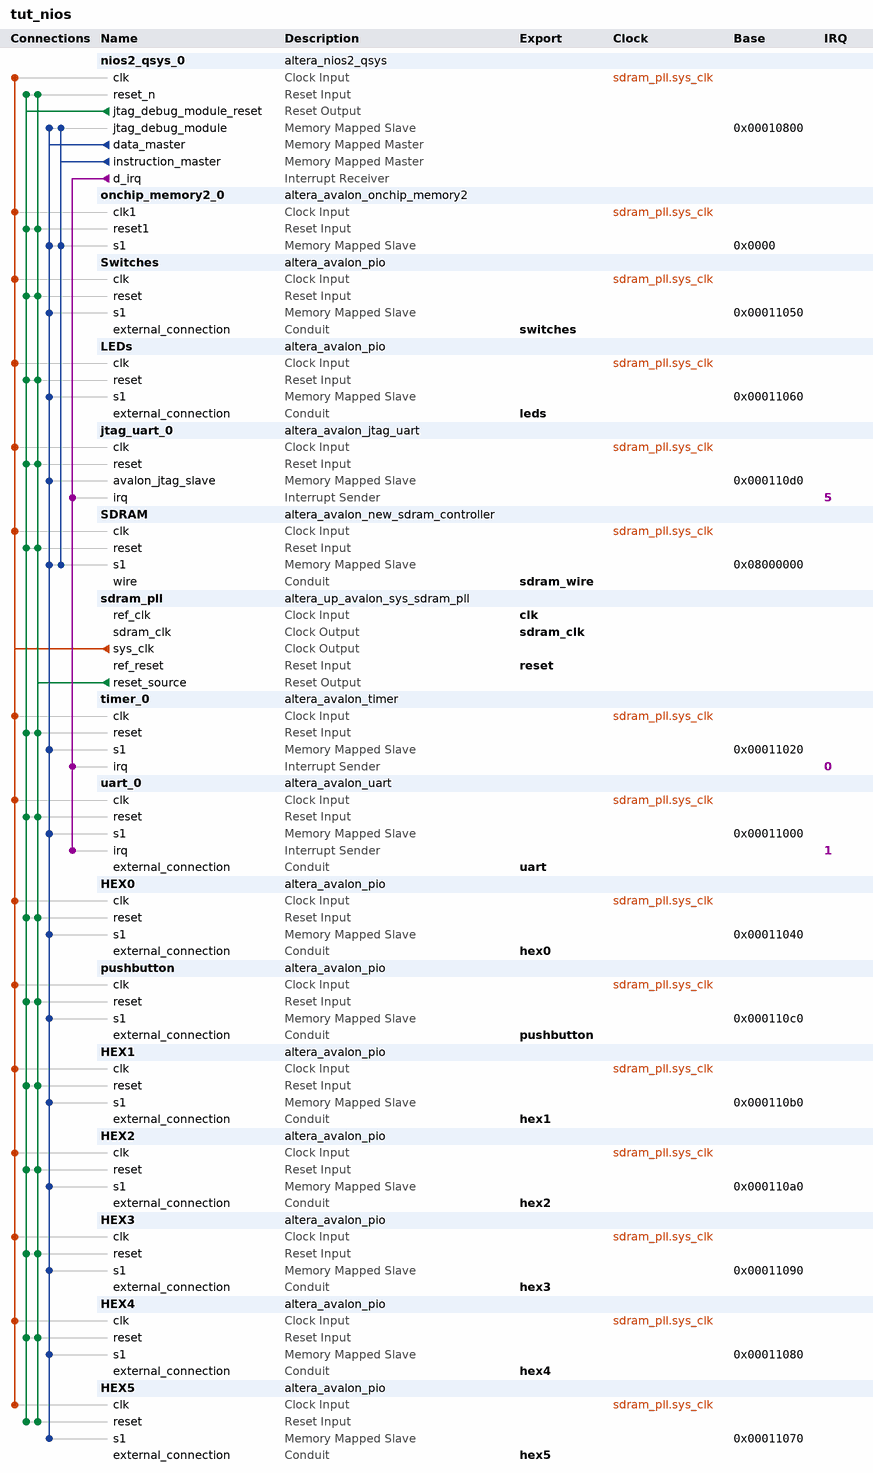
[diagram p0: system contents]
# Platform Designer (Qsys) system tut_nios, Cyclone V 5CSEMA5F31C6
# Parameters at their usual value, and those the tool derives, are not listed.
package require -exact qsys 15.0
create_system tut_nios
set_project_property DEVICE_FAMILY {Cyclone V}
set_project_property DEVICE 5CSEMA5F31C6

add_instance nios2_qsys_0 altera_nios2_qsys 15.0
set_instance_parameter_value nios2_qsys_0 breakSlave nios2_qsys_0.jtag_debug_module
set_instance_parameter_value nios2_qsys_0 exceptionSlave SDRAM.s1
set_instance_parameter_value nios2_qsys_0 icache_size 4096
set_instance_parameter_value nios2_qsys_0 impl Tiny
set_instance_parameter_value nios2_qsys_0 mmu_TLBMissExcSlave None
set_instance_parameter_value nios2_qsys_0 resetSlave SDRAM.s1
set_instance_parameter_value nios2_qsys_0 resetrequest_enabled false

add_instance onchip_memory2_0 altera_avalon_onchip_memory2 15.0
set_instance_parameter_value onchip_memory2_0 dataWidth 32
set_instance_parameter_value onchip_memory2_0 dualPort false
set_instance_parameter_value onchip_memory2_0 initMemContent true
set_instance_parameter_value onchip_memory2_0 initializationFileName onchip_mem.hex
set_instance_parameter_value onchip_memory2_0 memorySize 40960

add_instance Switches altera_avalon_pio 15.0
set_instance_parameter_value Switches direction Input
set_instance_parameter_value Switches width 8

add_instance LEDs altera_avalon_pio 15.0
set_instance_parameter_value LEDs direction Output
set_instance_parameter_value LEDs width 8

add_instance jtag_uart_0 altera_avalon_jtag_uart 15.0
set_instance_parameter_value jtag_uart_0 simInteractiveOptions NO_INTERACTIVE_WINDOWS

add_instance SDRAM altera_avalon_new_sdram_controller 15.0
set_instance_parameter_value SDRAM TAC 5.4
set_instance_parameter_value SDRAM TRCD 15.0
set_instance_parameter_value SDRAM TRP 15.0
set_instance_parameter_value SDRAM casLatency 3
set_instance_parameter_value SDRAM columnWidth 10
set_instance_parameter_value SDRAM dataWidth 16
set_instance_parameter_value SDRAM generateSimulationModel false
set_instance_parameter_value SDRAM model single_Micron_MT48LC4M32B2_7_chip
set_instance_parameter_value SDRAM numberOfBanks 4
set_instance_parameter_value SDRAM numberOfChipSelects 1
set_instance_parameter_value SDRAM powerUpDelay 100.0
set_instance_parameter_value SDRAM refreshPeriod 7.8125
set_instance_parameter_value SDRAM rowWidth 13

add_instance sdram_pll altera_up_avalon_sys_sdram_pll 15.0
set_instance_parameter_value sdram_pll CV_boards DE1-SoC
set_instance_parameter_value sdram_pll gui_outclk 50.0
set_instance_parameter_value sdram_pll gui_refclk 50.0

add_instance timer_0 altera_avalon_timer 15.0
set_instance_parameter_value timer_0 period 1
set_instance_parameter_value timer_0 periodUnits MSEC

add_instance uart_0 altera_avalon_uart 15.0
set_instance_parameter_value uart_0 baud 9600
set_instance_parameter_value uart_0 dataBits 8
set_instance_parameter_value uart_0 fixedBaud true
set_instance_parameter_value uart_0 parity NONE
set_instance_parameter_value uart_0 stopBits 1

add_instance HEX0 altera_avalon_pio 15.0
set_instance_parameter_value HEX0 direction Output
set_instance_parameter_value HEX0 width 4

add_instance pushbutton altera_avalon_pio 15.0
set_instance_parameter_value pushbutton direction Input
set_instance_parameter_value pushbutton width 1

add_instance HEX1 altera_avalon_pio 15.0
set_instance_parameter_value HEX1 direction Output
set_instance_parameter_value HEX1 width 4

add_instance HEX2 altera_avalon_pio 15.0
set_instance_parameter_value HEX2 direction Output
set_instance_parameter_value HEX2 width 4

add_instance HEX3 altera_avalon_pio 15.0
set_instance_parameter_value HEX3 direction Output
set_instance_parameter_value HEX3 width 4

add_instance HEX4 altera_avalon_pio 15.0
set_instance_parameter_value HEX4 direction Output
set_instance_parameter_value HEX4 width 4

add_instance HEX5 altera_avalon_pio 15.0
set_instance_parameter_value HEX5 direction Output
set_instance_parameter_value HEX5 width 4

# connections
add_connection sdram_pll.sys_clk HEX0.clk clock
add_connection sdram_pll.sys_clk HEX1.clk clock
add_connection sdram_pll.sys_clk HEX2.clk clock
add_connection sdram_pll.sys_clk HEX3.clk clock
add_connection sdram_pll.sys_clk HEX4.clk clock
add_connection sdram_pll.sys_clk HEX5.clk clock
add_connection sdram_pll.sys_clk jtag_uart_0.clk clock
add_connection sdram_pll.sys_clk LEDs.clk clock
add_connection sdram_pll.sys_clk nios2_qsys_0.clk clock
add_connection sdram_pll.sys_clk onchip_memory2_0.clk1 clock
add_connection sdram_pll.sys_clk pushbutton.clk clock
add_connection sdram_pll.sys_clk SDRAM.clk clock
add_connection sdram_pll.sys_clk Switches.clk clock
add_connection sdram_pll.sys_clk timer_0.clk clock
add_connection sdram_pll.sys_clk uart_0.clk clock
add_connection nios2_qsys_0.jtag_debug_module_reset HEX0.reset reset
add_connection nios2_qsys_0.jtag_debug_module_reset HEX1.reset reset
add_connection nios2_qsys_0.jtag_debug_module_reset HEX2.reset reset
add_connection nios2_qsys_0.jtag_debug_module_reset HEX3.reset reset
add_connection nios2_qsys_0.jtag_debug_module_reset HEX4.reset reset
add_connection nios2_qsys_0.jtag_debug_module_reset HEX5.reset reset
add_connection nios2_qsys_0.jtag_debug_module_reset jtag_uart_0.reset reset
add_connection nios2_qsys_0.jtag_debug_module_reset LEDs.reset reset
add_connection nios2_qsys_0.jtag_debug_module_reset nios2_qsys_0.reset_n reset
add_connection nios2_qsys_0.jtag_debug_module_reset onchip_memory2_0.reset1 reset
add_connection nios2_qsys_0.jtag_debug_module_reset pushbutton.reset reset
add_connection nios2_qsys_0.jtag_debug_module_reset SDRAM.reset reset
add_connection nios2_qsys_0.jtag_debug_module_reset Switches.reset reset
add_connection nios2_qsys_0.jtag_debug_module_reset timer_0.reset reset
add_connection nios2_qsys_0.jtag_debug_module_reset uart_0.reset reset
add_connection sdram_pll.reset_source HEX0.reset reset
add_connection sdram_pll.reset_source HEX1.reset reset
add_connection sdram_pll.reset_source HEX2.reset reset
add_connection sdram_pll.reset_source HEX3.reset reset
add_connection sdram_pll.reset_source HEX4.reset reset
add_connection sdram_pll.reset_source HEX5.reset reset
add_connection sdram_pll.reset_source jtag_uart_0.reset reset
add_connection sdram_pll.reset_source LEDs.reset reset
add_connection sdram_pll.reset_source nios2_qsys_0.reset_n reset
add_connection sdram_pll.reset_source onchip_memory2_0.reset1 reset
add_connection sdram_pll.reset_source pushbutton.reset reset
add_connection sdram_pll.reset_source SDRAM.reset reset
add_connection sdram_pll.reset_source Switches.reset reset
add_connection sdram_pll.reset_source timer_0.reset reset
add_connection sdram_pll.reset_source uart_0.reset reset
add_connection nios2_qsys_0.data_master HEX0.s1 avalon
set_connection_parameter_value nios2_qsys_0.data_master/HEX0.s1 baseAddress 0x00011040
add_connection nios2_qsys_0.data_master HEX1.s1 avalon
set_connection_parameter_value nios2_qsys_0.data_master/HEX1.s1 baseAddress 0x000110b0
add_connection nios2_qsys_0.data_master HEX2.s1 avalon
set_connection_parameter_value nios2_qsys_0.data_master/HEX2.s1 baseAddress 0x000110a0
add_connection nios2_qsys_0.data_master HEX3.s1 avalon
set_connection_parameter_value nios2_qsys_0.data_master/HEX3.s1 baseAddress 0x00011090
add_connection nios2_qsys_0.data_master HEX4.s1 avalon
set_connection_parameter_value nios2_qsys_0.data_master/HEX4.s1 baseAddress 0x00011080
add_connection nios2_qsys_0.data_master HEX5.s1 avalon
set_connection_parameter_value nios2_qsys_0.data_master/HEX5.s1 baseAddress 0x00011070
add_connection nios2_qsys_0.data_master jtag_uart_0.avalon_jtag_slave avalon
set_connection_parameter_value nios2_qsys_0.data_master/jtag_uart_0.avalon_jtag_slave baseAddress 0x000110d0
add_connection nios2_qsys_0.data_master LEDs.s1 avalon
set_connection_parameter_value nios2_qsys_0.data_master/LEDs.s1 baseAddress 0x00011060
add_connection nios2_qsys_0.data_master nios2_qsys_0.jtag_debug_module avalon
set_connection_parameter_value nios2_qsys_0.data_master/nios2_qsys_0.jtag_debug_module baseAddress 0x00010800
add_connection nios2_qsys_0.data_master onchip_memory2_0.s1 avalon
set_connection_parameter_value nios2_qsys_0.data_master/onchip_memory2_0.s1 baseAddress 0x0000
add_connection nios2_qsys_0.data_master pushbutton.s1 avalon
set_connection_parameter_value nios2_qsys_0.data_master/pushbutton.s1 baseAddress 0x000110c0
add_connection nios2_qsys_0.data_master SDRAM.s1 avalon
set_connection_parameter_value nios2_qsys_0.data_master/SDRAM.s1 baseAddress 0x08000000
add_connection nios2_qsys_0.data_master Switches.s1 avalon
set_connection_parameter_value nios2_qsys_0.data_master/Switches.s1 baseAddress 0x00011050
add_connection nios2_qsys_0.data_master timer_0.s1 avalon
set_connection_parameter_value nios2_qsys_0.data_master/timer_0.s1 baseAddress 0x00011020
add_connection nios2_qsys_0.data_master uart_0.s1 avalon
set_connection_parameter_value nios2_qsys_0.data_master/uart_0.s1 baseAddress 0x00011000
add_connection nios2_qsys_0.instruction_master nios2_qsys_0.jtag_debug_module avalon
set_connection_parameter_value nios2_qsys_0.instruction_master/nios2_qsys_0.jtag_debug_module baseAddress 0x00010800
add_connection nios2_qsys_0.instruction_master onchip_memory2_0.s1 avalon
set_connection_parameter_value nios2_qsys_0.instruction_master/onchip_memory2_0.s1 baseAddress 0x0000
add_connection nios2_qsys_0.instruction_master SDRAM.s1 avalon
set_connection_parameter_value nios2_qsys_0.instruction_master/SDRAM.s1 baseAddress 0x08000000
add_connection nios2_qsys_0.d_irq jtag_uart_0.irq interrupt
set_connection_parameter_value nios2_qsys_0.d_irq/jtag_uart_0.irq irqNumber 5
add_connection nios2_qsys_0.d_irq timer_0.irq interrupt
set_connection_parameter_value nios2_qsys_0.d_irq/timer_0.irq irqNumber 0
add_connection nios2_qsys_0.d_irq uart_0.irq interrupt
set_connection_parameter_value nios2_qsys_0.d_irq/uart_0.irq irqNumber 1

# exported interfaces
add_interface clk clock sink
set_interface_property clk EXPORT_OF sdram_pll.ref_clk
add_interface hex0 conduit end
set_interface_property hex0 EXPORT_OF HEX0.external_connection
add_interface hex1 conduit end
set_interface_property hex1 EXPORT_OF HEX1.external_connection
add_interface hex2 conduit end
set_interface_property hex2 EXPORT_OF HEX2.external_connection
add_interface hex3 conduit end
set_interface_property hex3 EXPORT_OF HEX3.external_connection
add_interface hex4 conduit end
set_interface_property hex4 EXPORT_OF HEX4.external_connection
add_interface hex5 conduit end
set_interface_property hex5 EXPORT_OF HEX5.external_connection
add_interface leds conduit end
set_interface_property leds EXPORT_OF LEDs.external_connection
add_interface pushbutton conduit end
set_interface_property pushbutton EXPORT_OF pushbutton.external_connection
add_interface reset reset sink
set_interface_property reset EXPORT_OF sdram_pll.ref_reset
add_interface sdram_clk clock source
set_interface_property sdram_clk EXPORT_OF sdram_pll.sdram_clk
add_interface sdram_wire conduit end
set_interface_property sdram_wire EXPORT_OF SDRAM.wire
add_interface switches conduit end
set_interface_property switches EXPORT_OF Switches.external_connection
add_interface uart conduit end
set_interface_property uart EXPORT_OF uart_0.external_connection

set_interconnect_requirement {$system} qsys_mm.clockCrossingAdapter HANDSHAKE
set_interconnect_requirement {$system} qsys_mm.enableEccProtection FALSE
set_interconnect_requirement {$system} qsys_mm.insertDefaultSlave FALSE
set_interconnect_requirement {$system} qsys_mm.maxAdditionalLatency 1

save_system tut_nios.qsys
